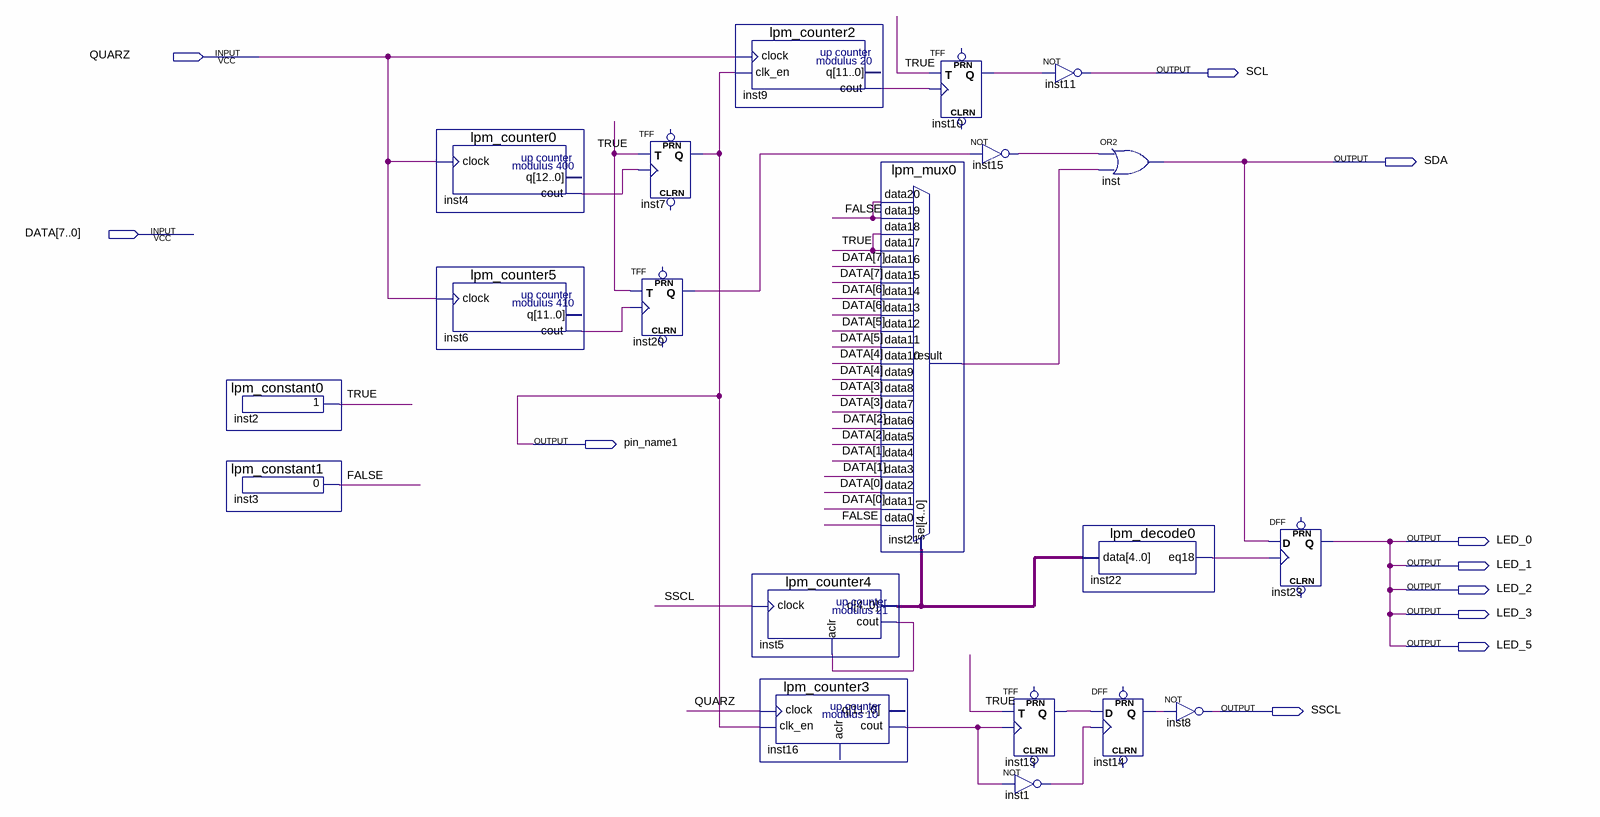
[diagram p0: schematic sheet]
// Quartus schematic i2c.bdf as structural Verilog: 20 symbols, 11 pins
module i2c (
  input  QUARZ,
  input  [7:0] DATA,
  output SCL,
  output SDA,
  output pin_name1,
  output LED_0,
  output LED_1,
  output LED_2,
  output LED_3,
  output LED_5,
  output SSCL
);

  wire FALSE, inst1_out, inst4_cout, inst5_cout, inst6_cout, inst9_cout, inst10_q, inst13_q, inst14_q,
       inst15_out, inst16_cout, inst20_q, inst21_result, inst22_eq18, TRUE;
  wire [4:0] inst5_q;

  lpm_constant0 inst2 (.result(TRUE));
  lpm_constant1 inst3 (.result(FALSE));
  lpm_counter0 inst4 (.clock(QUARZ), .cout(inst4_cout));  // open: q
  lpm_counter5 inst6 (.clock(QUARZ), .cout(inst6_cout));  // open: q
  TFF inst7 (.T(TRUE), .CLK(inst4_cout), .Q(pin_name1));  // open: PRN, CLRN
  TFF inst20 (.T(TRUE), .CLK(inst6_cout), .Q(inst20_q));  // open: PRN, CLRN
  lpm_counter2 inst9 (.clock(QUARZ), .clk_en(pin_name1), .cout(inst9_cout));  // open: q
  lpm_counter4 inst5 (.clock(SSCL), .aclr(inst5_cout), .cout(inst5_cout), .q(inst5_q));
  lpm_counter3 inst16 (.clock(QUARZ), .clk_en(pin_name1), .cout(inst16_cout));  // open: aclr, q
  TFF inst10 (.T(TRUE), .CLK(inst9_cout), .Q(inst10_q));  // open: PRN, CLRN
  lpm_mux0 inst21 (
    .data20(FALSE), .data19(FALSE), .data18(TRUE), .data17(TRUE), .data16(DATA[7]), .data15(DATA[7]),
    .data14(DATA[6]), .data13(DATA[6]), .data12(DATA[5]), .data11(DATA[5]), .data10(DATA[4]),
    .data9(DATA[4]), .data8(DATA[3]), .data7(DATA[3]), .data6(DATA[2]), .data5(DATA[2]), .data4(DATA[1]),
    .data3(DATA[1]), .data2(DATA[0]), .data1(DATA[0]), .data0(FALSE), .sel(inst5_q), .result(inst21_result));
  not inst15 (inst15_out, inst20_q);
  TFF inst13 (.T(TRUE), .CLK(inst16_cout), .Q(inst13_q));  // open: PRN, CLRN
  not inst1 (inst1_out, inst16_cout);
  not inst11 (SCL, inst10_q);
  or inst (SDA, inst15_out, inst21_result);
  lpm_decode0 inst22 (.data(inst5_q), .eq18(inst22_eq18));
  DFF inst14 (.CLK(inst1_out), .D(inst13_q), .Q(inst14_q));  // open: CLRN, PRN
  not inst8 (SSCL, inst14_q);
  DFF inst23 (.CLK(inst22_eq18), .D(SDA), .Q(LED_0));  // open: CLRN, PRN

  assign LED_1 = LED_0;
  assign LED_2 = LED_0;
  assign LED_3 = LED_0;
  assign LED_5 = LED_0;
endmodule
